# EAGLE design IcspAdapter (EAGLE 7.5.0)
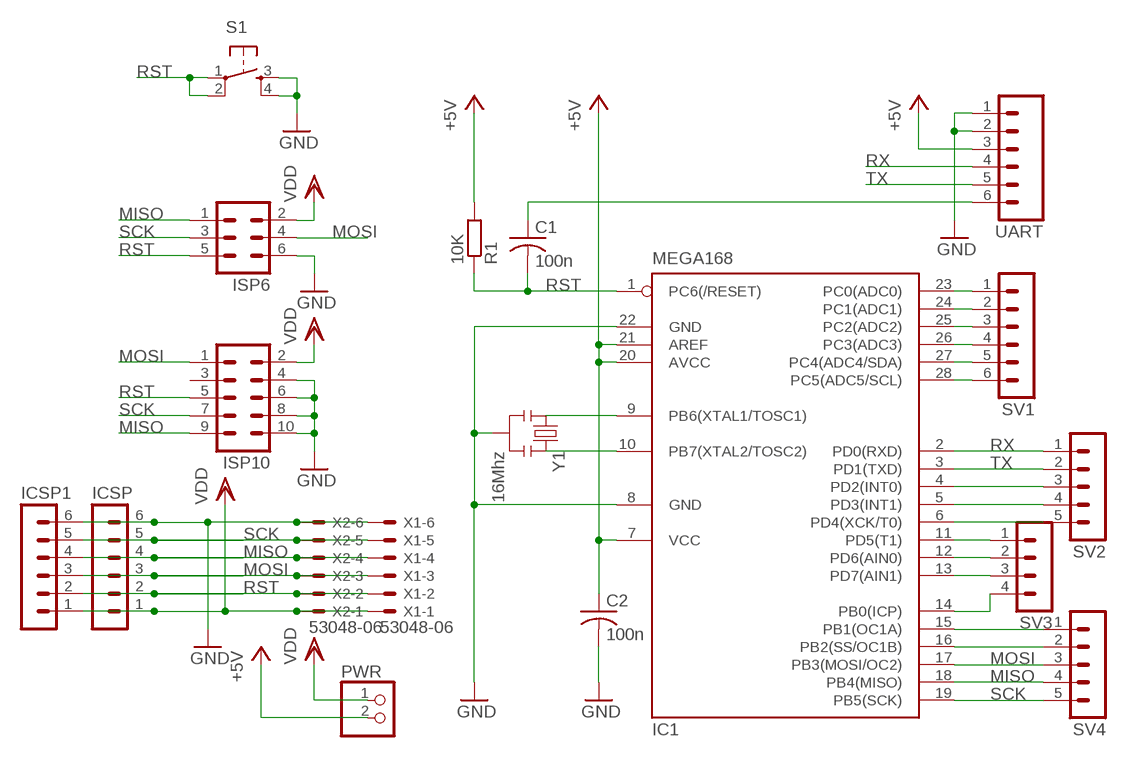
[diagram p0: schematic, sheet 1]

## Parts
C1  100n  C-US050-024X044  [C050-024X044]
C2  100n  C-US050-024X044  [C050-024X044]
IC1  MEGA168  MEGA8-P  [DIL28-3]
ICSP  MA06-1  [MA06-1]
ICSP1  MA06-1  [MA06-1]
ISP6  MA03-2  [MA03-2]
ISP10  MA05-2  [MA05-2]
PWR  PINHD-1X2  [1X02]
R1  10K  R-EU_0204/7  [0204/7]
S1  TAC_SWITCHPTH  [TACTILE-PTH]
SV1  MA06-1  [MA06-1]
SV2  MA05-1  [MA05-1]
SV3  MA04-1  [MA04-1]
SV4  MA05-1  [MA05-1]
UART  M06SIP  [1X06]
X1  53048-06  [53048-06]
X2  53048-06  [53048-06]
Y1  16Mhz  RESONATORPTH  [RESONATOR-PTH]

## Nets
+5V: C2.1 IC1.7(VCC) IC1.20(AVCC) IC1.21(AREF) PWR.2 R1.2 UART.3
GND: C2.2 IC1.8(GND) IC1.22(GND) ICSP1.6 ICSP.6 ISP6.6 ISP10.4 ISP10.6 ISP10.8 ISP10.10 S1.3 S1.4 UART.1 UART.2 X1.6 X2.6 Y1.2
MISO: IC1.18(PB4(MISO)) ICSP1.4 ICSP.4 ISP6.1 ISP10.9 SV4.4 X1.4 X2.4
MOSI: IC1.17(PB3(MOSI/OC2)) ICSP1.3 ICSP.3 ISP6.4 ISP10.1 SV4.3 X1.3 X2.3
N$1: IC1.23(PC0(ADC0)) SV1.1
N$3: IC1.24(PC1(ADC1)) SV1.2
N$4: IC1.25(PC2(ADC2)) SV1.3
N$5: IC1.26(PC3(ADC3)) SV1.4
N$6: IC1.16(PB2(SS/OC1B)) SV4.2
N$7: IC1.9(PB6(XTAL1/TOSC1)) Y1.1
N$8: IC1.10(PB7(XTAL2/TOSC2)) Y1.3
N$9: IC1.27(PC4(ADC4/SDA)) SV1.5
N$10: IC1.28(PC5(ADC5/SCL)) SV1.6
N$11: C1.1 UART.6
N$13: IC1.4(PD2(INT0)) SV2.3
N$14: IC1.5(PD3(INT1)) SV2.4
N$15: IC1.6(PD4(XCK/T0)) SV2.5
N$16: IC1.11(PD5(T1)) SV3.1
N$17: IC1.12(PD6(AIN0)) SV3.2
N$18: IC1.13(PD7(AIN1)) SV3.3
N$19: IC1.14(PB0(ICP)) SV3.4
N$20: IC1.15(PB1(OC1A)) SV4.1
RST: C1.2 IC1.1(PC6(/RESET)) ICSP1.2 ICSP.2 ISP6.5 ISP10.5 R1.1 S1.1 S1.2 X1.2 X2.2
RX: IC1.2(PD0(RXD)) SV2.1 UART.4
SCK: IC1.19(PB5(SCK)) ICSP1.5 ICSP.5 ISP6.3 ISP10.7 SV4.5 X1.5 X2.5
TX: IC1.3(PD1(TXD)) SV2.2 UART.5
VDD: ICSP1.1 ICSP.1 ISP6.2 ISP10.2 PWR.1 X1.1 X2.1
Unconnected: ISP10.3

## Library data of the parts
C1 C2 = rcl:C-US: CAPACITOR, American symbol
IC1 = atmel:MEGA8-P: MICROCONTROLLER 8 Kbytes FLASH, 1 kbytes SRAM, 512 bytes EEPROM, USART, 4-channel 10 bit ADC, 2-channel 8 bit ADC Pin compatible with Atmega48, ATMega88, ATMega168 Source: avr.lbr; OC_FARNELL: unknown; OC_NEWARK: unknown
ICSP ICSP1 SV1 = con-lstb:MA06-1: PIN HEADER; OC_FARNELL: unknown; OC_NEWARK: unknown
ISP6 = con-lstb:MA03-2: PIN HEADER; OC_FARNELL: unknown; OC_NEWARK: unknown
ISP10 = con-lstb:MA05-2: PIN HEADER; OC_FARNELL: unknown; OC_NEWARK: unknown
PWR = pinhead:PINHD-1X2: PIN HEADER
R1 = rcl:R-EU_: RESISTOR, European symbol
S1 = SparkFun:TAC_SWITCH: Momentary Switch Button commonly used for reset or general input. Spark Fun Electronics SKU : COM-00097
SV2 SV4 = con-lstb:MA05-1: PIN HEADER; OC_FARNELL: unknown; OC_NEWARK: unknown
SV3 = con-lstb:MA04-1: PIN HEADER; OC_FARNELL: unknown; OC_NEWARK: unknown
UART = SparkFun:M06: Header 6 Standard 6-pin 0.1" header. Use with straight break away headers (SKU : PRT-00116), right angle break away headers (PRT-00553), swiss pins (PRT-00743), machine pins (PRT-00117), and female headers (PRT-00115). Molex polarized connector foot print use with SKU : PRT-08094 with associated crimp pins and housings. NOTES ON THE VARIANTS LOCK and LOCK_LONGPADS... This footprint was designed to help hold the alignment of a through-hole component (i.e. 6-pin header) while soldering it into place. You may notice that each hole has been shifted either up or down by 0.005 of an inch from it's more standard position (which is a perfectly straight line). This slight alteration caused the pins (the squares in the middle) to touch the edges of the holes. Because they are alternating, it causes a "brace" to hold the component in place. 0.005 has proven to be the perfect amount of "off-center" position when using our standard breakaway headers. Although looks a little odd when you look at the bare footprint, once you have a header in there, the alteration is very hard to notice. Also, if you push a header all the way into place, it is covered up entirely on the bottom side. This idea of altering the position of holes to aid alignment will be further integrated into the Sparkfun Library for other footprints. It can help hold any component with 3 or more connection pins.
X1 X2 = con-molex:53?-06: CONNECTOR wire to board 1.25 mm (.049 inch) pitch header; MF: WALDOM/MOLEX; MPN: 53048-0610; OC_FARNELL: 1012260; OC_NEWARK: 38C9911
Y1 = SparkFun:RESONATOR: Resonator Small SMD resonator. This is the itty bitty 10/20MHz resonators with built in caps. CSTCE10M0G55 and CSTCE20M0V53. Footprint has been reviewed closely but hasn't been tested yet.

## Net classes
1 power: width 0.178 mm, drill 0.305 mm, clearance 0.178 mm to class 0, clearance 0.178 mm

## Board
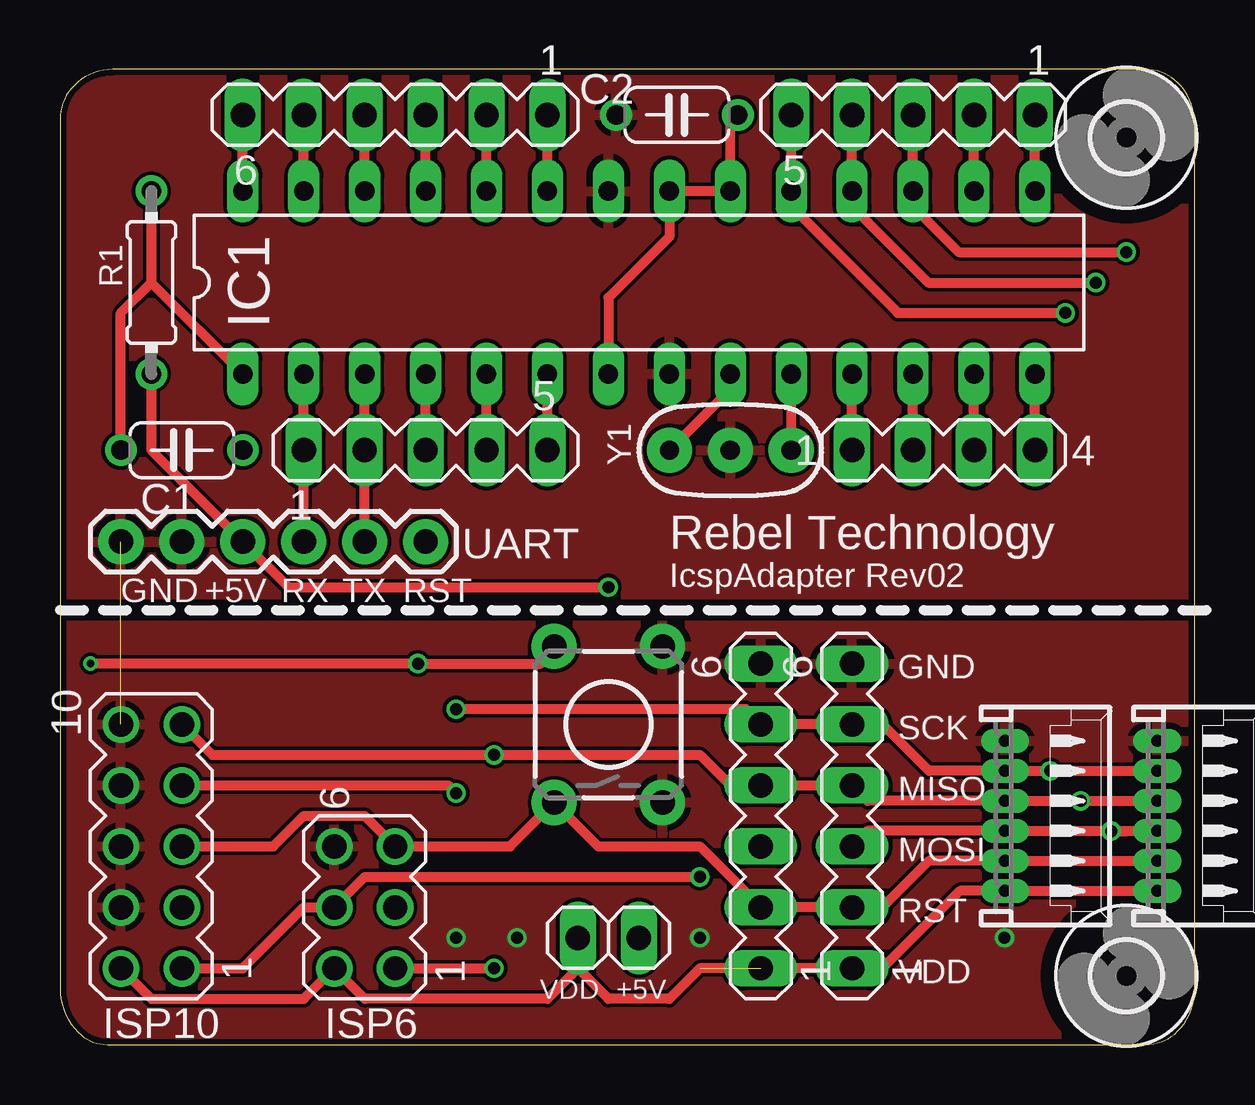
[diagram p1: board, top side]
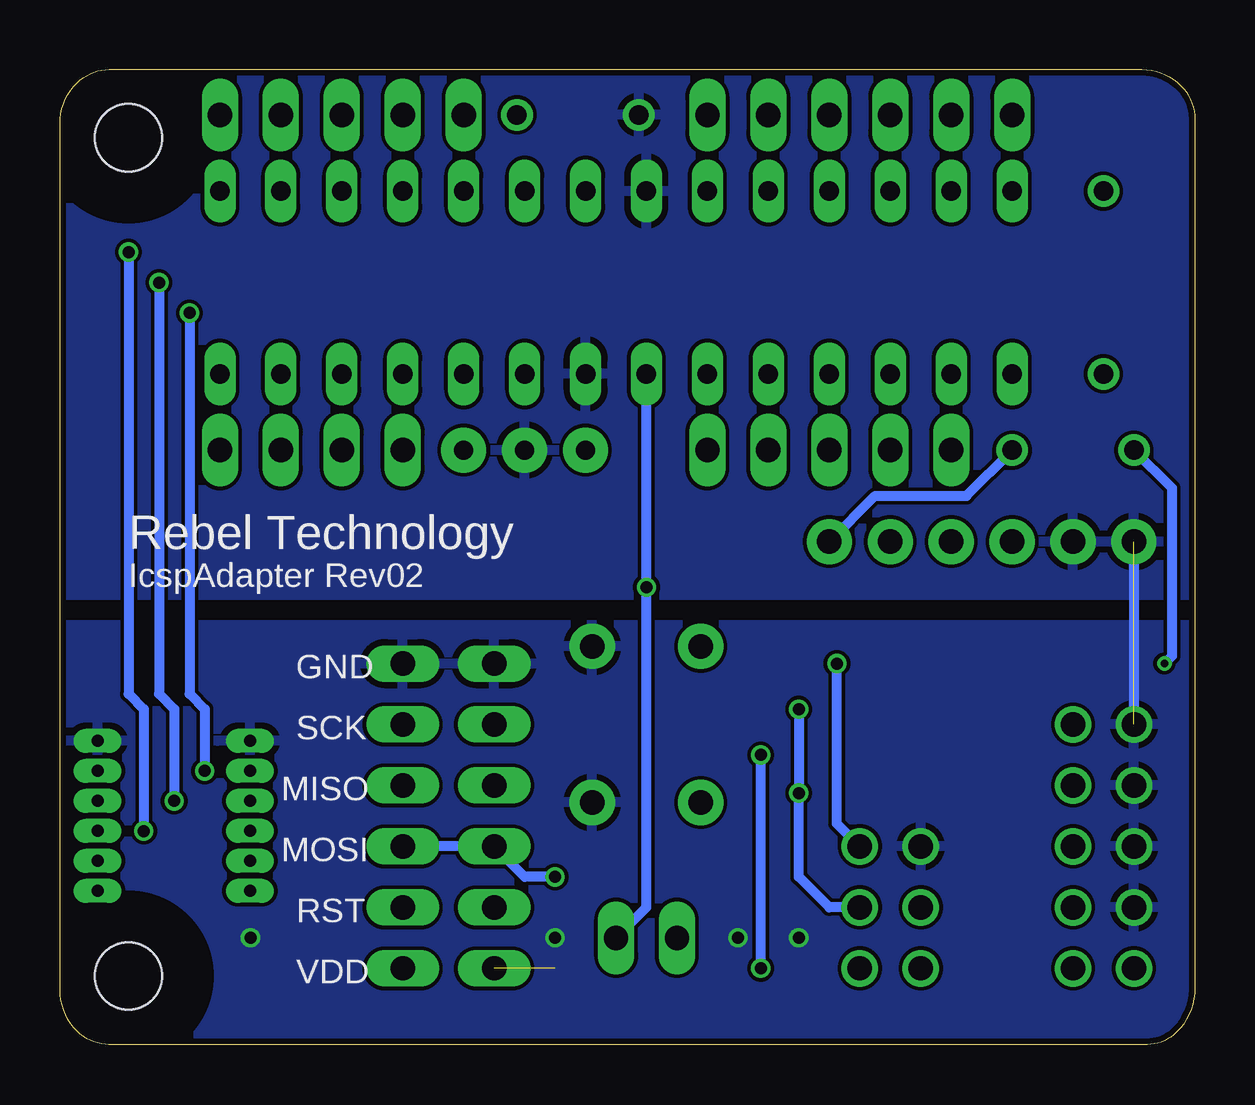
[diagram p2: board, bottom side, seen from below]

Size 47.31 x 40.63 mm. Coordinates in mm from the lower left corner, seen from the top.
Outline: 0.77,0.5 arc45 1.98,0 45.27,0 arc45 46.58,0.54 arc45 47.31,2.3 47.31,38.37 arc45 46.6,40.07 arc45 45.25,40.63 2.2,40.63 arc45 0.59,39.96 arc45 0,38.54 0,2.35 arc45 0.77,0.5
Copper layers (1*16): Top 0.035mm / dielectric 1.5mm / Bottom 0.035mm
Design rules "SeeedStudio_2layer_DRU_no_angle_20140221": minimum track width 6mil, minimum drill 12mil, track to track 6mil, track to pad 6mil, pad to pad 6mil, via to via 6mil, smd to smd 0mil, copper to edge 10mil, drill to drill 10mil, minimum pad ring 10mil, minimum via ring 6mil, stop-mask expansion 2mil, vias tented up to drill 100mil, thermal gap 10mil

### Footprints (pad centres in the part's own frame; a part is rotated, then mirrored left to right if it is on the bottom)
C050-024X044 = drill 0.813: 1 -2.54,0; 2 2.54,0
DIL28-3 = drill 0.813 long: 1 -16.51,-3.81; 2 -13.97,-3.81; 3 -11.43,-3.81; 4 -8.89,-3.81; 5 -6.35,-3.81; 6 -3.81,-3.81; 7 -1.27,-3.81; 8 1.27,-3.81; 9 3.81,-3.81; 10 6.35,-3.81; 11 8.89,-3.81; 12 11.43,-3.81; 13 13.97,-3.81; 14 16.51,-3.81; 15 16.51,3.81; 16 13.97,3.81; 17 11.43,3.81; 18 8.89,3.81; 19 6.35,3.81; 20 3.81,3.81; 21 1.27,3.81; 22 -1.27,3.81; 23 -3.81,3.81; 24 -6.35,3.81; 25 -8.89,3.81; 26 -11.43,3.81; 27 -13.97,3.81; 28 -16.51,3.81
MA06-1 = drill 1.016 long: 1 -6.35,0; 2 -3.81,0; 3 -1.27,0; 4 1.27,0; 5 3.81,0; 6 6.35,0
MA03-2 = drill 1.016: 1 -2.54,-1.27; 2 -2.54,1.27; 3 0,-1.27; 4 0,1.27; 5 2.54,-1.27; 6 2.54,1.27
MA05-2 = drill 1.016: 1 -5.08,-1.27; 2 -5.08,1.27; 3 -2.54,-1.27; 4 -2.54,1.27; 5 0,-1.27; 6 0,1.27; 7 2.54,-1.27; 8 2.54,1.27; 9 5.08,-1.27; 10 5.08,1.27
1X02 = drill 1.016 long: 1 -1.27,0; 2 1.27,0
0204/7 = drill 0.813: 1 -3.81,0; 2 3.81,0
TACTILE-PTH = drill 1.016 pad 1.88: 1 -3.251,2.261; 2 3.251,2.261; 3 -3.251,-2.261; 4 3.251,-2.261
MA05-1 = drill 1.016 long: 1 -5.08,0; 2 -2.54,0; 3 0,0; 4 2.54,0; 5 5.08,0
MA04-1 = drill 1.016 long: 1 -3.81,0; 2 -1.27,0; 3 1.27,0; 4 3.81,0
2,8 = hole 2.8: 0,0
1X06 = drill 1.016 pad 1.88: 1 0,0; 2 2.54,0; 3 5.08,0; 4 7.62,0; 5 10.16,0; 6 12.7,0
53048-06 = drill 0.5 pad 0.698 long: 1 3.125,-1.25; 2 1.875,-1.25; 3 0.625,-1.25; 4 -0.625,-1.25; 5 -1.875,-1.25; 6 -3.125,-1.25
RESONATOR-PTH = drill 0.8 pad 1.88: 1 -2.54,0; 2 0,0; 3 2.54,0

### Placement (x,y rotation side)
C1  5.08,24.77 180 top
C2  25.72,38.73 180 top
IC1  24.13,31.75 0 top
ICSP  33.02,9.53 90 top
ICSP1  29.21,9.53 90 top
ISP6  12.7,5.71 90 top
ISP10  3.81,8.25 90 top
PWR  22.86,4.45 0 top
R1  3.81,31.75 270 top
S1  22.86,13.34 90 top
SV1  13.97,38.73 180 top
SV2  15.24,24.77 0 top
SV3  36.83,24.77 0 top
SV4  35.56,38.73 180 top
U$1  [2,8]  44.45,2.86 0 top
U$5  [2,8]  44.45,37.78 0 top
UART  2.54,20.95 0 top
X1  46.99,9.53 270 top
X2  40.64,9.53 270 top
Y1  27.94,24.77 0 top

### Tracks (layer width: path | path; a pad name or v marks a point on that pad's centre or on a via)
+5V  (via drill 0.5)
  Top 0.406: R1.2 3.81,24.77 UART.3 9.53,19.05 v22.86,19.05 | C2.1 27.94,38.42 IC1.20 IC1.21 25.4,33.66 22.86,31.12 IC1.7
  Bottom 0.406: PWR.2 22.86,5.71 v22.86,19.05 IC1.7
GND  (via drill 0.5)  (1 unrouted)
  Bottom 0.406: UART.1 ISP10.10
  other vias: 26.67,4.45 19.05,4.45 16.51,4.45 39.37,4.45
  pour Bottom: -3.81,17.46 54.61,17.46 54.61,-6.99 -3.81,-6.99
  pour Top: -3.81,17.46 55.88,17.46 55.88,-8.26 -3.81,-8.26
  pour Bottom: -3.81,43.18 54.61,43.18 54.61,18.73 -3.81,18.73
  pour Top: -3.81,44.45 55.88,44.45 55.88,18.73 -3.81,18.73
MISO  (via drill 0.5)
  Top 0.406: ISP10.9 6.35,12.07 v18.1,12.07 26.67,12.07 27.94,10.79 ICSP1.4 ICSP.4 33.66,10.15 X2.4 v42.55,10.15 X1.4 | v43.18,31.75 36.2,31.75 33.02,34.92 IC1.18 SV4.4 | ISP6.1 v18.1,3.17
  Bottom 0.406: v43.18,31.75 43.18,14.61 42.55,13.97 v42.55,10.15 | v18.1,3.17 v18.1,12.07
MOSI  (via drill 0.5)
  Top 0.406: ICSP.3 33.66,8.9 X2.3 X1.3 44.48,8.89 v43.81,8.89 | ISP10.1 7.62,3.17 10.16,5.71 ISP6.4 12.7,6.98 v26.67,6.98 | v44.45,33.02 37.47,33.02 35.56,34.92 IC1.17 SV4.3
  Bottom 0.406: v44.45,33.02 44.45,14.61 43.81,13.97 v43.81,8.89 | v26.67,6.98 27.94,6.98 ICSP1.3 ICSP.3
N$1
  Top 0.406: IC1.23 SV1.1
N$3
  Top 0.406: IC1.24 SV1.2
N$4
  Top 0.406: IC1.25 SV1.3
N$5
  Top 0.406: IC1.26 SV1.4
N$6
  Top 0.406: IC1.16 SV4.2
N$7
  Top 0.406: IC1.9 27.94,27.3 Y1.1
N$8
  Top 0.406: Y1.3 IC1.10
N$9
  Top 0.406: IC1.27 SV1.5
N$10
  Top 0.406: IC1.28 SV1.6
N$11
  Bottom 0.406: UART.6 13.34,22.86 9.53,22.86 C1.1
N$13
  Top 0.406: SV2.3 IC1.4
N$14
  Top 0.406: SV2.4 IC1.5
N$15
  Top 0.406: SV2.5 IC1.6
N$16
  Top 0.406: SV3.1 IC1.11
N$17
  Top 0.406: SV3.2 IC1.12
N$18
  Top 0.406: SV3.3 IC1.13
N$19
  Top 0.406: SV3.4 IC1.14
N$20
  Top 0.406: IC1.15 SV4.1
RST  (via drill 0.3, 0.5)
  Top 0.406: X1.2 X2.2 36.23,7.65 34.29,5.71 ICSP.2 ICSP1.2 26.67,8.25 22.43,8.25 S1.1 18.77,8.25 ISP6.5 12.7,9.53 10.16,9.53 8.89,8.25 ISP10.5 | S1.2 20.04,15.88 v14.92,15.88 v1.27,15.88 | R1.1 3.81,31.75 | 3.81,31.75 IC1.1 | C1.2 2.54,30.48 3.81,31.75
  Bottom 0.406: ISP6.5 14.92,9.21 v14.92,15.88 | v1.27,15.88 0.95,16.19 0.95,23.18 C1.2
RX
  Top 0.406: UART.4 SV2.1 IC1.2
SCK  (via drill 0.5)
  Top 0.406: X1.5 v41.27,11.4 X2.5 36.23,11.4 34.29,13.34 ICSP.5 ICSP1.5 28.57,13.97 v16.51,13.97 | v41.91,30.48 34.92,30.48 30.48,34.92 IC1.19 SV4.5 | ISP10.7 16.19,10.79 v16.51,10.48
  Bottom 0.406: v41.91,30.48 41.91,14.61 41.27,13.97 v41.27,11.4 | ISP6.3 15.24,5.71 16.51,6.98 v16.51,10.48 v16.51,13.97
TX
  Top 0.406: UART.5 SV2.2 IC1.3
VDD  (1 unrouted)
  Top 0.406: X1.1 X2.1 37.52,6.4 34.29,3.17 ICSP.1 26.67,3.17 25.4,1.9 22.86,1.9 21.59,3.17 | ISP10.2 3.81,1.9 10.16,1.9 ISP6.2 12.7,1.9 20.32,1.9 21.59,3.17 | PWR.1 21.59,3.17

### Text on the board
tPlace: Y1 | Rebel Technology | GND | +5V | RX | TX | RST | IcspAdapter Rev02 | GND | SCK | MISO | MOSI | RST | VDD | VDD | +5V
bPlace: Rebel Technology | IcspAdapter Rev02 | GND | SCK | MISO | MOSI | RST | VDD